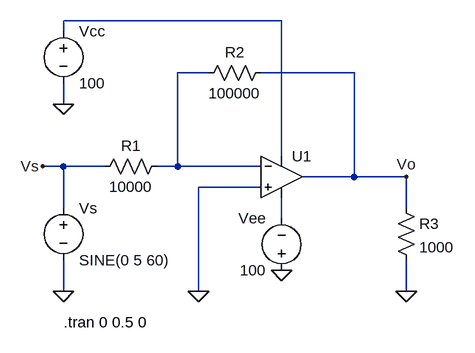
[diagram p0: schematic assig1_q1.asc]
assig1_q1.asc, the LTspice schematic file:
Version 4
SHEET 1 880 680
WIRE 256 80 -80 80
WIRE -80 96 -80 80
WIRE 144 160 96 160
WIRE 368 160 224 160
WIRE -80 208 -80 176
WIRE 256 288 256 80
WIRE -80 304 -112 304
WIRE -16 304 -80 304
WIRE 96 304 96 160
WIRE 96 304 64 304
WIRE 224 304 96 304
WIRE 368 320 368 160
WIRE 368 320 288 320
WIRE 448 320 368 320
WIRE 224 336 128 336
WIRE -80 368 -80 304
WIRE 448 368 448 320
WIRE 256 384 256 352
WIRE -80 496 -80 448
WIRE 128 496 128 336
WIRE 448 496 448 448
FLAG -80 496 0
FLAG 448 320 Vo
FLAG -112 304 Vs
FLAG -80 208 0
FLAG 256 464 0
FLAG 128 496 0
FLAG 448 496 0
SYMBOL OpAmps\\UniversalOpamp2 256 320 R0
SYMATTR InstName U1
SYMBOL voltage -80 352 R0
WINDOW 123 0 0 Left 0
WINDOW 39 0 0 Left 0
SYMATTR InstName Vs
SYMATTR Value SINE(0 5 60)
SYMBOL voltage 256 480 R180
WINDOW 0 24 96 Left 2
WINDOW 3 24 16 Left 2
WINDOW 123 0 0 Left 0
WINDOW 39 0 0 Left 0
SYMATTR InstName Vee
SYMATTR Value 100
SYMBOL voltage -80 80 R0
WINDOW 123 0 0 Left 0
WINDOW 39 0 0 Left 0
SYMATTR InstName Vcc
SYMATTR Value 100
SYMBOL res 80 288 R90
WINDOW 0 0 56 VBottom 2
WINDOW 3 32 56 VTop 2
SYMATTR InstName R1
SYMATTR Value 10000
SYMBOL res 240 144 R90
WINDOW 0 0 56 VBottom 2
WINDOW 3 32 56 VTop 2
SYMATTR InstName R2
SYMATTR Value 100000
SYMBOL res 432 352 R0
SYMATTR InstName R3
SYMATTR Value 1000
TEXT -80 544 Left 2 !.tran 0 0.5 0

The netlist it stands for:
* assig1_q1.asc
XU1 0 N002 N001 N003 Vo level.2 Avol=1Meg GBW=10Meg Slew=10Meg ilimit=25m rail=0 Vos=0 phimargin=45 en=0 enk=0 in=0 ink=0 Rin=500Meg  ; pins IN+ IN- V+ V- OUT
Vs Vs 0 SINE(0 5 60)
Vee 0 N003 100
Vcc N001 0 100
R1 N002 Vs 10000
R2 Vo N002 100000
R3 Vo 0 1000
.tran 0 0.5 0
.lib UniversalOpamps2.sub
.backanno
.end